# EAGLE design Router40 v2 (EAGLE 9.5.0)
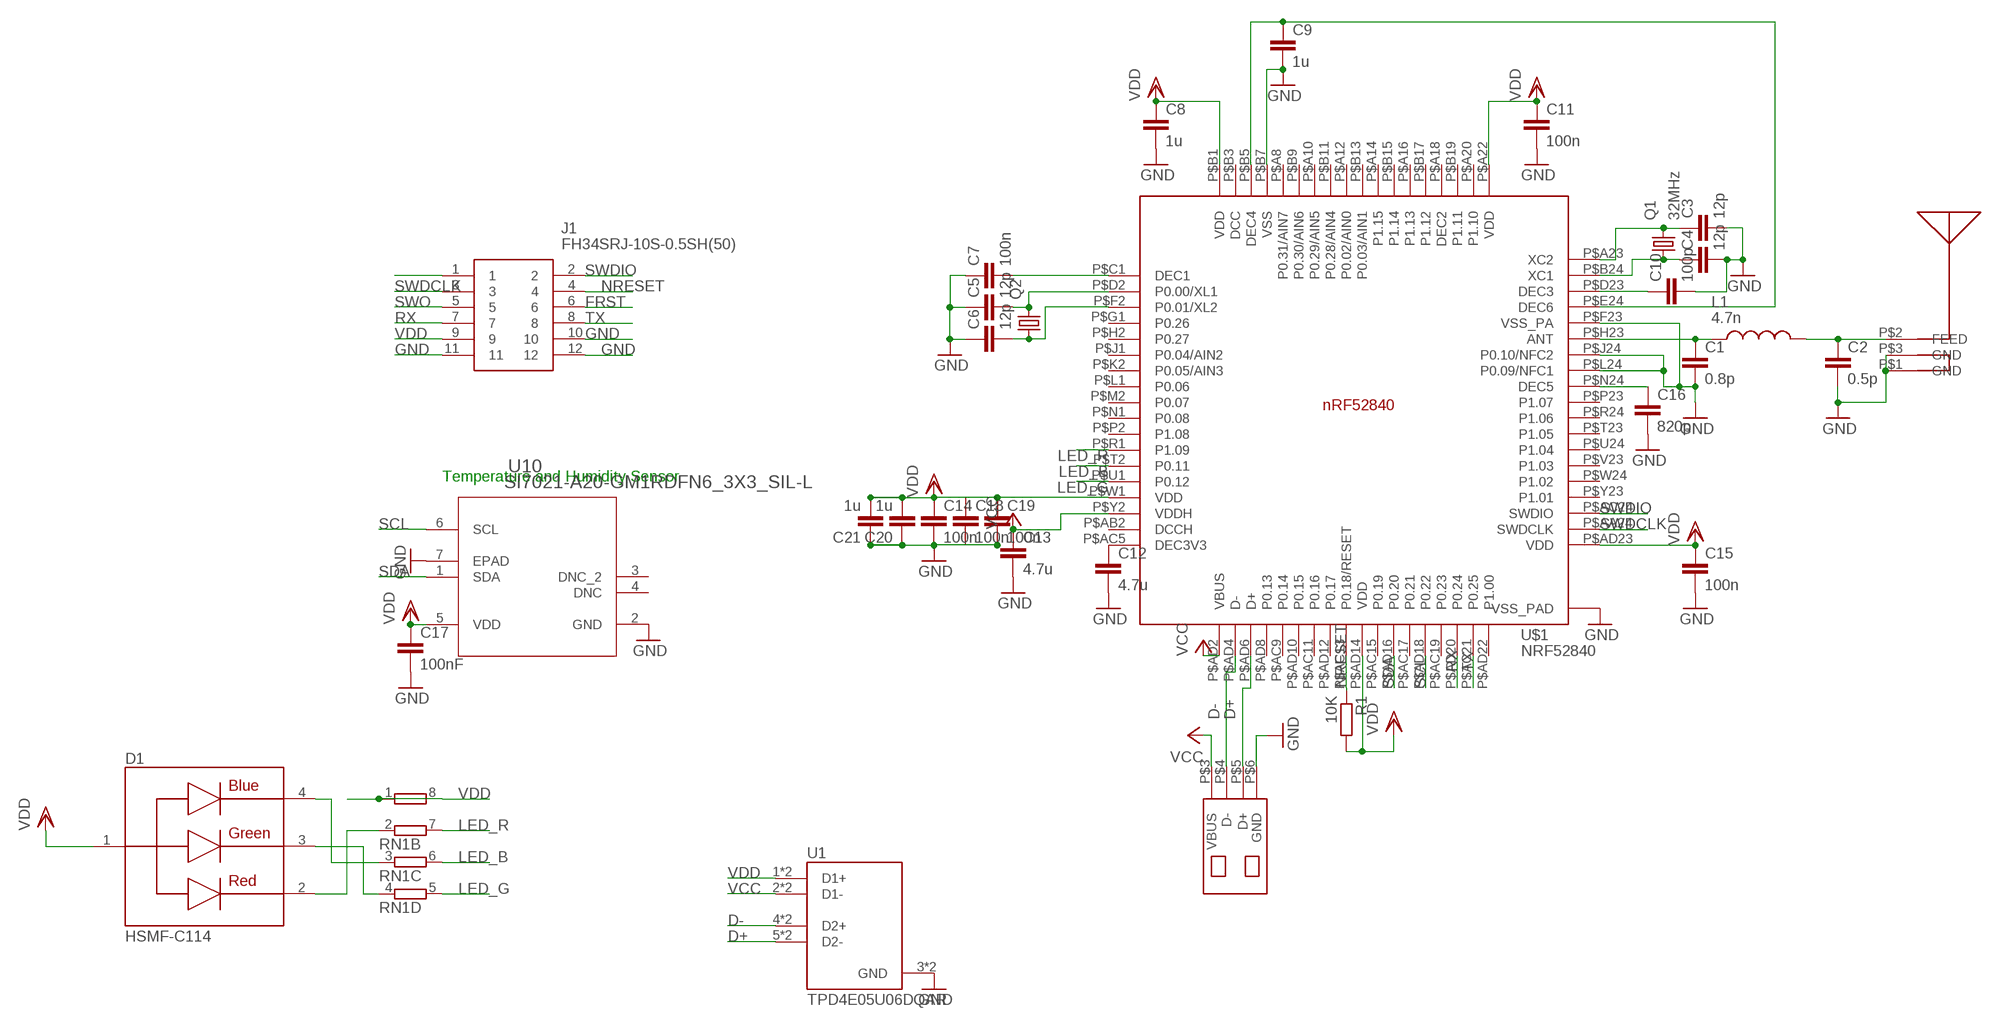
[diagram p0: schematic, sheet 1]

## Parts
C1  0.8p  CC0402  [C0402]
C2  0.5p  CC0402  [C0402]
C3  12p  CC0402  [C0402]
C4  12p  CC0402  [C0402]
C5  12p  CC0402  [C0402]
C6  12p  CC0402  [C0402]
C7  100n  CC0402  [C0402]
C8  1u  CC0402  [C0402]
C9  1u  CC0402  [C0402]
C10  100p  CC0402  [C0402]
C11  100n  CC0402  [C0402]
C12  4.7u  CC0402  [C0402]
C13  4.7u  CC0402  [C0402]
C14  100n  CC0402  [C0402]
C15  100n  CC0402  [C0402]
C16  820p  CC0402  [C0402]
C17  100nF  CC0402  [C0402]
C18  100n  CC0402  [C0402]
C19  100n  CC0402  [C0402]
C20  1u  CC0603R  [C0603R]
C21  1u  CC0603R  [C0603R]
D1  HSMF-C114  [DIOSC160X150X35-4N]
J1  FH34SRJ-10S-0.5SH(50)  [FH34SRJ10S05SH50]
L1  4.7n  MHQ0402P7N5JT000  [INDC0402X26N]
Q1  32MHz  KX-5  [2.0X1.6_KX-5]
Q2  KX-327-RT  [2.0X1.2]
R1  10K  RR0402  [R0402]
RN1  4R-N0402ARV341  [4X0402ARV341]
U1  TPD4E05U06DQAR  [TI_TPD4E05U06DQAR]
U10  SI7021-A20-GM1RDFN6_3X3_SIL-L  [DFN6_3X3_SIL-L]
U$1  NRF52840  [AQFN50P700X700X85_HS-74N]
U$2  USBA_MALE  [USBA_MALE]
U$4  CHIPANTENNAL2  [CHIPANTENNAL2]

## Nets
D+: U1.5(D2-) U1.6(D2-) U$1.P$AD6(D+) U$2.P$5(D+)
D-: U1.4(D2+) U1.7(D2+) U$1.P$AD4(D-) U$2.P$4(D-)
FRST: J1.6
GND: C1.2 C2.2 C3.2 C4.2 C5.1 C6.1 C7.1 C8.2 C9.2 C10.2 C11.2 C12.2 C13.2 C14.2 C15.2 C16.2 C17.2 C18.2 C19.2 C20.1 C21.1 J1.10 J1.11 J1.12 U1.3(GND) U1.8(GND) U10.2(GND) U10.7(EPAD) U$1.P$74(VSS_PAD) U$1.P$75(VSS_PAD) U$1.P$76(VSS_PAD) U$1.P$77(VSS_PAD) U$1.P$78(VSS_PAD) U$1.P$79(VSS_PAD) U$1.P$80(VSS_PAD) U$1.P$81(VSS_PAD) U$1.P$82(VSS_PAD) U$1.P$83(VSS_PAD) U$1.P$84(VSS_PAD) U$1.P$85(VSS_PAD) U$1.P$86(VSS_PAD) U$1.P$87(VSS_PAD) U$1.P$88(VSS_PAD) U$1.P$89(VSS_PAD) U$1.P$90(VSS_PAD) U$1.P$B7(VSS) U$1.P$F23(VSS_PA) U$1.P$J24(P0.10/NFC2) U$1.P$L24(P0.09/NFC1) U$2.P$6(GND) U$4.P$1(GND) U$4.P$3(GND)
LED_B: RN1.6 U$1.P$T2(P0.11)
LED_G: RN1.5 U$1.P$U1(P0.12)
LED_R: RN1.7 U$1.P$R1(P1.09)
N$1: C1.1 L1.1 U$1.P$H23(ANT)
N$2: C2.1 L1.2 U$4.P$2(FEED)
N$3: C3.1 Q1.3 U$1.P$A23(XC2)
N$4: C4.1 Q1.1 U$1.P$B24(XC1)
N$5: C5.2 Q2.2 U$1.P$D2(P0.00/XL1)
N$6: C6.2 Q2.1 U$1.P$F2(P0.01/XL2)
N$7: C7.2 U$1.P$C1(DEC1)
N$8: C9.1 U$1.P$B5(DEC4) U$1.P$E24(DEC6)
N$9: C10.1 U$1.P$D23(DEC3)
N$10: C12.1 U$1.P$AC5(DEC3V3)
N$12: C16.1 U$1.P$N24(DEC5)
N$14: J1.1
N$16: D1.2 RN1.2
N$17: D1.3 RN1.4
N$18: D1.4 RN1.3
NRESET: J1.4 R1.1 U$1.P$AC13(P0.18/RESET)
RX: J1.7 U$1.P$AD20(P0.24)
SCL: U10.6(SCL) U$1.P$AD18(P0.22)
SDA: U10.1(SDA) U$1.P$AD16(P0.20)
SWDCLK: J1.3 U$1.P$AA24(SWDCLK)
SWDIO: J1.2 U$1.P$AC24(SWDIO)
SWO: J1.5
TX: J1.8 U$1.P$AC21(P0.25)
VCC: C13.1 U1.2(D1-) U1.9(D1-) U$1.P$AD2(VBUS) U$1.P$Y2(VDDH) U$2.P$3(VBUS)
VDD: C8.1 C11.1 C14.1 C15.1 C17.1 C18.1 C19.1 C20.2 C21.2 D1.1 J1.9 R1.2 RN1.1 RN1.8 U1.1(D1+) U1.10(D1+) U10.5(VDD) U$1.P$A22(VDD) U$1.P$AD14(VDD) U$1.P$AD23(VDD) U$1.P$B1(VDD) U$1.P$W1(VDD)
Unconnected: U10.3(DNC_2) U10.4(DNC) U$1.P$A8(P0.31/AIN7) U$1.P$A10(P0.29/AIN5) U$1.P$A12(P0.02/AIN0) U$1.P$A14(P1.15) U$1.P$A16(P1.13) U$1.P$A18(DEC2) U$1.P$A20(P1.10) U$1.P$AB2(DCCH) U$1.P$AC9(P0.14) U$1.P$AC11(P0.16) U$1.P$AC15(P0.19) U$1.P$AC17(P0.21) U$1.P$AC19(P0.23) U$1.P$AD8(P0.13) U$1.P$AD10(P0.15) U$1.P$AD12(P0.17) U$1.P$AD22(P1.00) U$1.P$B3(DCC) U$1.P$B9(P0.30/AIN6) U$1.P$B11(P0.28/AIN4) U$1.P$B13(P0.03/AIN1) U$1.P$B15(P1.14) U$1.P$B17(P1.12) U$1.P$B19(P1.11) U$1.P$G1(P0.26) U$1.P$H2(P0.27) U$1.P$J1(P0.04/AIN2) U$1.P$K2(P0.05/AIN3) U$1.P$L1(P0.06) U$1.P$M2(P0.07) U$1.P$N1(P0.08) U$1.P$P2(P1.08) U$1.P$P23(P1.07) U$1.P$R24(P1.06) U$1.P$T23(P1.05) U$1.P$U24(P1.04) U$1.P$V23(P1.03) U$1.P$W24(P1.02) U$1.P$Y23(P1.01)

## Notes on the sheet
- Temperature and Humidity Sensor

## Library data of the parts
C1-C19 = eagle-ltspice:C: CAPACITOR, European symbol; SPICEMODEL: NONE; SPICEPREFIX: C
C20 C21 = eagle-ltspice:C: CAPACITOR, European symbol
D1 = HSMF-C114:HSMF-C114: LED Tri-Color Blue/Green/Red 468nm/523nm/637nm 4-Pin Chip LED T/R; AVAILABILITY: Unavailable; DESCRIPTION: LED RGB DIFFUSED CHIP SMD; MF: Broadcom Limited; MP: HSMF-C114; PACKAGE: 0606 Broadcom; PRICE: None
J1 = FH34SRJ-10S-0.5SH_50_:FH34SRJ-10S-0.5SH(50): HIROSE(HRS) - FH34SRJ-10S-0.5SH(50) - CONNECTOR, FFC/FPC, RCPT, 10POS, 1ROW Source: Datasheet <https://www.hirose.com/product/en/products/FH34SRJ/FH34SRJ-10S-0.5SH(50)/> Check prices <https://pricing.snapeda.com/search/part/FH34SRJ-10S-0.5SH%2850%29/?ref=eda>; AVAILABILITY: Good; DESCRIPTION: FFC & FPC Connectors 10POS 0.50MM R/A CONN FFC FPC; MF: Hirose Connector; MP: FH34SRJ-10S-0.5SH(50); PACKAGE: None; PRICE: None; PURCHASE-URL: https://pricing.snapeda.com/search/part/FH34SRJ-10S-0.5SH(50)/?ref=eda
L1 = MHQ0402P7N5JT000:MHQ0402P7N5JT000: 221 NH 5% GOLD TERMINAL; AVAILABILITY: Unavailable; DESCRIPTION: FIXED IND 7.5NH 200MA 1.2 OHM; MF: TDK; MP: MHQ0402P7N5JT000; PACKAGE: 0402 TDK; PRICE: None
Q1 = crystal-geyer_V1_0:KX: Quartz Crystals (MHz) SMD: KX - Serie Model Size l/w/h [mm] Frequency Range Frequency Stability Temp. Range [°C] Load Capacitance AECQ 200 availabel Datasheet KX-4 KX-5 KX-6 KX-7 KX-9A KX-9B KX-12A KX-12B KX-13 KX-20 KX-K KX-KS 1.6/1.2/0.3 2.0/1.6/0.45 2.5/2.0/0.55 3.2/2.5/0.8 5.0/3.2/1.0 5.0/3.2/1.1 6.0/3.5/1.1 6.0/3.5/1.0 7.0/5.0 /1.3 11.6/5.5/1.6 12.3/4.5/4.2 12.3/4.5/3.2 24.0 ~ 80.0 MHz 16.0 ~ 80.0 MHz 12.0 ~ 80.0 MHz 8.0 ~ 60.0 MHz 7,68 ~ 300,0 MHz 8,0 ~ 50,0 MHz 8,0 ~ 150,0 MHz 8,0 ~ 50,0 MHz 6,0 ~ 160,0 MHz 3,579 ~ 25,0 MHz 3,579 ~ 70,0 MHz 3,579 ~ 70,0 MHz ±10 … ±50ppm ±10 … ±50ppm ±10 … ±50ppm ±10 … ±50ppm ±10 … ±50ppm ±10 … ±50ppm ±10 … ±50ppm ±10 … ±50ppm ±10 … ±50ppm ±50ppm ±10 … ±50ppm ±10 … ±50ppm (*) -40°C …+85°C (*) -40°C …+125°C (*) -40°C …+125°C (*) -40°C …+125°C (*) -40°C …+105°C (*) -40°C …+105°C (*) -40°C …+125°C (*) -40°C …+105°C (*) -40°C …+105°C (*) -40°C …+105°C (*) -40°C …+85°C (*) -40°C …+85°C 8, 8…16 8, 8…16 10, 8…16 12, 7…20 16, 10…20 16, 10…20 16, 10…20 16, 12…20 16, 12…20 16, 12…20 16, 12…30 16, 12…30 - yes yes yes - - - - - - - - KX-4.pdf <http://www.geyer-electronic.de/uploads/tx_userartikelfrequenz/GEYER-KX-4.pdf> KX-5.pdf <http://www.geyer-electronic.de/uploads/tx_userartikelfrequenz/GEYER-KX-5.pdf> KX-6.pdf <http://www.geyer-electronic.de/uploads/tx_userartikelfrequenz/GEYER-KX-6.pdf> KX-7.pdf <http://www.geyer-electronic.de/uploads/tx_userartikelfrequenz/GEYER-KX-7.pdf> KX-9A.pdf <http://www.geyer-electronic.de/uploads/tx_userartikelfrequenz/GEYER-KX-9A.pdf> KX-9B.pdf <http://www.geyer-electronic.de/uploads/tx_userartikelfrequenz/GEYER-KX-9B.pdf> KX-12A.pdf <http://www.geyer-electronic.de/uploads/tx_userartikelfrequenz/GEYER-KX-12A.pdf> KX-12B.pdf <http://www.geyer-electronic.de/uploads/tx_userartikelfrequenz/GEYER-KX-12B.pdf> KX-13.pdf <http://www.geyer-electronic.de/uploads/tx_userartikelfrequenz/GEYER-KX-13.pdf> KX-20.pdf <http://www.geyer-electronic.de/uploads/tx_userartikelfrequenz/GEYER-KX-20.pdf> KX-K.pdf <http://www.geyer-electronic.de/uploads/tx_userartikelfrequenz/GEYER-KX-K.pdf> KX-KS.pdf <http://www.geyer-electronic.de/uploads/tx_userartikelfrequenz/GEYER-KX-KS.pdf> <http://www.geyer-electronic.de/fileadmin/template/img/logo-geyer-electronic.png> Details see: http://www.geyer-electronic.de/Frequenz-Produkte.9.0.html Created 2016-06-07, Hans Locher 2016 (C) Geyer Quartz Technology KX4,KX5,KX6,KX7,KX9A,KX9B,KX12A,KX12B,KX13,KX20,KXK,KXKS;1612;2016;2520;3225;5032;6035;7050;11655;12345;1,6x1,2;2,0x1,6;2,5x2,0;3,2x2,5;5,0x3,2;6,0x3,5;7,0x5,0;11,6x5,5;12,3x4,5;12,3x4,5;1.6x1.2;2.0x1.6;2.5x2.0;3.2x2.5;5.0x3.2;6.0x3.5;7.0x5.0;11.6x5.5;12.3x4.5;12.3x4.5;
Q2 = crystal-geyer_V1_0:KX-327: Tuning Fork Crystals (kHz) SMD: KX327 - Serie Model Size l/w/h [mm] Frequency Range Frequency Stability Temp. Range [°C] Load Capacitance AECQ 200 availabel Datasheet KX-327VT KX-327FT KX-327RT KX-327NHT KX-327NHF KX-327L KX-327S 1.25/1.05/0.5 1.6/1.0/0.5 2.0/1.2/0.6 3.2/1.5/0.8 3.2/1.5/0.8 7.0/1.5/1.4 8.2/3.8/2.5 32,768 kHz 32,768 kHz 32,768 kHz 32,768 kHz 32,768 kHz 32,768 kHz 32,768 kHz ±10 … ±20ppm ±10 … ±20ppm ±10 … ±20ppm ±10 … ±20ppm ±10 … ±20ppm ±10 … ±20ppm ±5 … ±20ppm (*) -40°C …+85°C (*) -40°C …+85°C (*) -40°C …+85°C (*) -40°C …+85°C (*) -40°C …+125°C (*) -40°C …+85°C (*) -40°C …+85°C 7/9/12,5 7/9/12,5 7/9/12,6 7/9/12,5 9/12,5 7/9/12,5 6/12,5 - - - - yes - - KX-327VT.pdf <http://www.geyer-electronic.de/uploads/tx_userartikelfrequenz/GEYER-KX-327VT.pdf> KX-327FT.pdf <http://www.geyer-electronic.de/uploads/tx_userartikelfrequenz/GEYER-KX-327FT.pdf> KX-327RT.pdf <http://www.geyer-electronic.de/uploads/tx_userartikelfrequenz/GEYER-KX-327RT.pdf> KX-327NHT.pdf <http://www.geyer-electronic.de/uploads/tx_userartikelfrequenz/GEYER-KX-327NHT.pdf> KX-327NHF.pdf <http://www.geyer-electronic.de/uploads/tx_userartikelfrequenz/GEYER-KX-327NHF.pdf> KX-327L.pdf <http://www.geyer-electronic.de/uploads/tx_userartikelfrequenz/GEYER-KX-327L.pdf> KX-327S.pdf <http://www.geyer-electronic.de/uploads/tx_userartikelfrequenz/GEYER-KX-327S.pdf> <http://www.geyer-electronic.de/fileadmin/template/img/logo-geyer-electronic.png> Details see: http://www.geyer-electronic.de/Frequenz-Produkte.9.0.html Created 2016-06-07, Hans Locher 2016 (C) Geyer Quartz Technology KX327VT,KX327FT,KX327RT,KX327NHT,KX327NHF,KX327S,KX327L;125105;1610;2012;3215;7015;8238;1,25x1,05,1.25x1.05;1,6x1,0,1.6x1.0;2,0x1,2,2.0x1.2;3,2x1,5,3.2x1.5;8,2x3,8,8.2x3.8,7.0x1.5,7,0x1,532.768kHz
R1 = eagle-ltspice:R: RESISTOR, European symbol; SPICEMODEL: NONE; SPICEPREFIX: R
RN1 = resistor-dil:4R-N: Array Chip Resistor Source: RS Component / Phycomp; OC_FARNELL: unknown; OC_NEWARK: unknown
U1 = TPD4E05U06DQAR:TPD4E05U06DQAR: 4 Channel Ultra Low Capacitance IEC ESD Protection Diodes 10-USON -40 to 125 Check prices <https://pricing.snapeda.com/search/part/TPD4E05U06DQAR/?ref=eda>; AVAILABILITY: Warning; DESCRIPTION: 4-channel ultra-low-capacitance IEC ESD protection diode 10-USON -40 to 125; MF: Texas Instruments; MP: TPD4E05U06DQAR; PACKAGE: USON-10 Texas Instruments; PRICE: None; PURCHASE-URL: https://pricing.snapeda.com/search/part/TPD4E05U06DQAR/?ref=eda
U10 = SI7021:SI7021-A20-GM1R; BUILT_BY: EMA_Jessica; COPYRIGHT: Copyright (C) 2018 Accelerated Designs. All rights reserved; MANUFACTURER_PART_NUMBER: SI7021-A20-GM1R; SOURCELIBRARY: Silicon_Labs_2020-01-01; VENDOR: Silicon Labs
U$1 = Nordic_nRF:NRF52840: nRF52840 Features Advanced Single chip 2.4 GHz multi-protocol SoC 32-bit ARM Cortex-M4F Processor 1.7v to 5.5v operation 1MB flash + 256kB RAM Bluetooth 5 support for long range and high throughput 802.15.4 radio support On-chip NFC PPI –Programmable Peripheral Interconnect Automated power management system with automatic power management of each peripheral Configurable I/O mapping for analog and digital I/O 48 x GPIO 1 x QSPI 4 x Master/Slave SPI 2 x Two-wire interface (I²C) I²S interface 2 x UART 4 x PWM USB 2.0 controller ARM TrustZone CryptoCell-310 Cryptographic and security module AES 128-bit ECB/CCM/AAR hardware accelerator Digital microphone interface (PDM) Quadrature decoder 12-bit ADC Low power comparator On-chip 50Ω balun On-air compatible with nRF52, nRF51 and nRF24 Series Applications Advanced high performance wearables Wearables for secure payments Virtual Reality/Augmented Reality systems Smart Home sensor networks Smart city sensor networks High performance HID controllers Internet of Things (IoT) sensor networks Smart door locks Smart lighting networks Connected white goods
U$2 = USB:USBA_MALE
U$4 = CHIPANTENNA:CHIPANTENNAL2

## Board
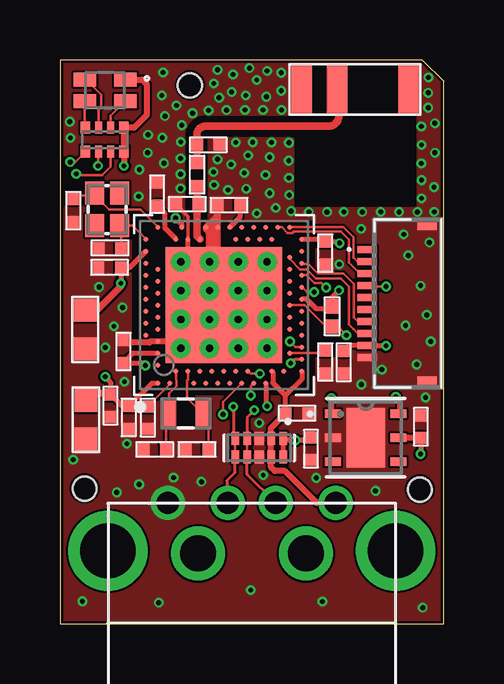
[diagram p1: board, top side]
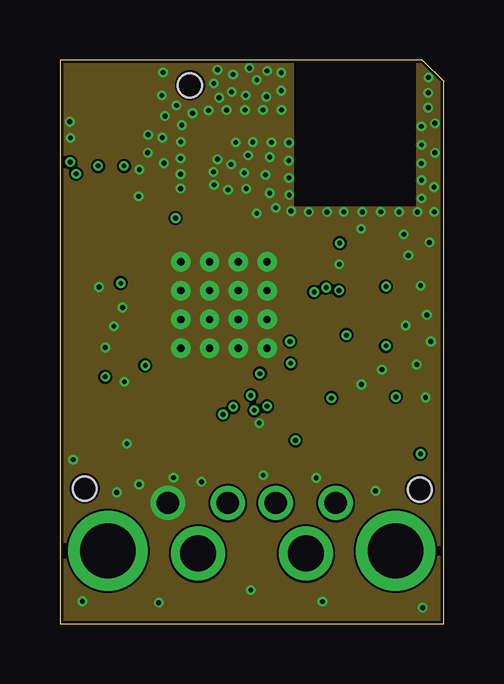
[diagram p2: board, inner layer Route2]
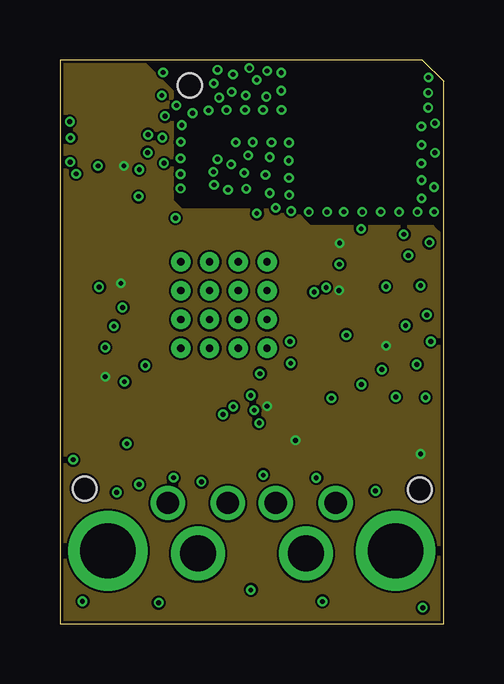
[diagram p3: board, inner layer Route15]
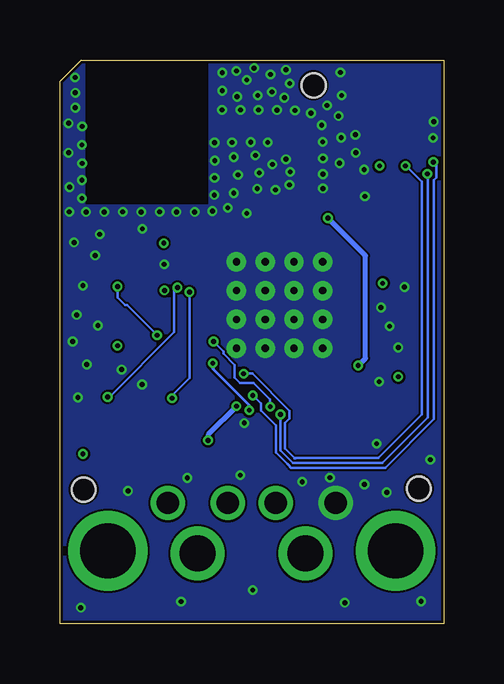
[diagram p4: board, bottom side, seen from below]

Size 16 x 23.5 mm. Coordinates in mm from the lower left corner, seen from the top.
Outline: 0,0 16,0 16,22.61 15.11,23.5 0,23.5 0,0
Copper layers (1+2*15+16): Top 0.035mm / dielectric 0.51mm / Route2 0.035mm / dielectric 0.15mm / Route15 0.035mm / dielectric 0.2mm / Bottom 0.035mm
Design rules "default *": minimum track width 3.5mil, minimum drill 0.2mm, track to track 3.5mil, track to pad 3.5mil, pad to pad 5mil, via to via 5mil, smd to smd 5mil, copper to edge 5mil, drill to drill 5mil, minimum pad ring 10mil, minimum via ring 4mil, stop-mask expansion 0mil, vias tented up to drill 40mil, thermal gap 0mil
Holes 1 mm at 1.03,5.63 5.42,22.44 15.01,5.59
tRestrict: 13 lines

### Footprints (pad centres in the part's own frame; a part is rotated, then mirrored left to right if it is on the bottom)
C0402 = smd 0.5 x 0.5: 1 -0.475,0; 2 0.475,0
C0603R = smd 0.95 x 0.95: 1 -0.85,0; 2 0.75,0
DIOSC160X150X35-4N = smd 0.94 x 0.57: 1 -0.845,-0.45; 2 -0.845,0.45; 3 0.845,0.45; 4 0.845,-0.45
FH34SRJ10S05SH50 = smd 0.3 x 0.8: 1 2.25,1.55; 2 1.75,1.55; 3 1.25,1.55; 4 0.75,1.55; 5 0.25,1.55; 6 -0.25,1.55; 7 -0.75,1.55; 8 -1.25,1.55; 9 -1.75,1.55; 10 -2.25,1.55 | smd 0.4 x 0.8: 11 -3.25,-0.95; 12 3.25,-0.95
INDC0402X26N = smd 0.5 x 0.5: 1 -0.732,0; 2 0.232,0
2.0X1.6_KX-5 = smd 0.95 x 0.8: 1 -0.675,-0.525; 2 0.675,-0.525; 3 0.675,0.525; 4 -0.675,0.525
2.0X1.2 = smd 0.6 x 1.1: 1 -0.7,0; 2 0.7,0
R0402 = smd 0.6 x 0.55: 1 -0.425,0; 2 0.425,0
4X0402ARV341 = smd 0.4 x 0.5: 1 -0.8,-0.5; 4 0.8,-0.5; 5 0.8,0.5; 8 -0.8,0.5 | smd 0.3 x 0.5: 2 -0.25,-0.5; 3 0.25,-0.5; 6 0.25,0.5; 7 -0.25,0.5
TI_TPD4E05U06DQAR = smd 0.55 x 0.3: 1 -0.385,1; 2 -0.385,0.5; 4 -0.385,-0.5; 5 -0.385,-1; 6 0.385,-1; 7 0.385,-0.5; 9 0.385,0.5; 10 0.385,1 | smd 0.55 x 0.4: 3 -0.385,0; 8 0.385,0
DFN6_3X3_SIL-L = smd 0.66 x 0.356: 1 -1.372,0.991; 2 -1.372,0; 3 -1.372,-0.991; 4 1.372,-0.991; 5 1.372,0; 6 1.372,0.991 | smd 1.6 x 2.489: 7 0,0
AQFN50P700X700X85_HS-74N = smd 4.85 x 4.85: P$74 0,0 | drill 0.3 pad 0.6: P$75 -1.8,1.8; P$76 -0.6,1.8; P$77 0.6,1.8; P$78 1.8,1.8; P$79 -1.8,0.6; P$80 -0.6,0.6; P$81 0.6,0.6; P$82 1.8,0.6; P$83 -1.8,-0.6; P$84 -0.6,-0.6; P$85 0.6,-0.6; P$86 1.8,-0.6; P$87 -1.8,-1.8; P$88 -0.6,-1.8; P$89 0.6,-1.8; P$90 1.8,-1.8 | smd 0.2 x 0.2: P$A8 -1.25,3.25; P$A10 -0.75,3.25; P$A12 -0.25,3.25; P$A14 0.25,3.25; P$A16 0.75,3.25; P$A18 1.25,3.25; P$A20 1.75,3.25; P$A22 2.25,3.25; P$A23 2.75,3.25; P$AA24 3.25,-2.25; P$AB2 -2.75,-2.5; P$AC5 -2,-2.75; P$AC9 -1,-2.75; P$AC11 -0.5,-2.75; P$AC13 0,-2.75; P$AC15 0.5,-2.75; P$AC17 1,-2.75; P$AC19 1.5,-2.75; P$AC21 2,-2.75; P$AC24 3.25,-2.75; P$AD2 -2.75,-3.25; P$AD4 -2.25,-3.25; P$AD6 -1.75,-3.25; P$AD8 -1.25,-3.25; P$AD10 -0.75,-3.25; P$AD12 -0.25,-3.25; P$AD14 0.25,-3.25; P$AD16 0.75,-3.25; P$AD18 1.25,-3.25; P$AD20 1.75,-3.25; P$AD22 2.25,-3.25; P$AD23 2.75,-3.25; P$B1 -3.25,2.75; P$B3 -2.5,2.75; P$B5 -2,2.75; P$B7 -1.5,2.75; P$B9 -1,2.75; P$B11 -0.5,2.75; P$B13 0,2.75; P$B15 0.5,2.75; P$B17 1,2.75; P$B19 1.5,2.75; P$B24 3.25,2.75; P$C1 -3.25,2.25; P$D2 -2.75,2; P$D23 2.75,2; P$E24 3.25,1.75; P$F2 -2.75,1.5; P$F23 2.75,1.5; P$G1 -3.25,1.25; P$H2 -2.75,1; P$H23 2.75,1; P$J1 -3.25,0.75; P$J24 3.25,0.75; P$K2 -2.75,0.5; P$L1 -3.25,0.25; P$L24 3.25,0.25; P$M2 -2.75,0; P$N1 -3.25,-0.25; P$N24 3.25,-0.25; P$P2 -2.75,-0.5; P$P23 2.75,-0.5; P$R1 -3.25,-0.75; P$R24 3.25,-0.75; P$T2 -2.75,-1; P$T23 2.75,-1; P$U1 -3.25,-1.25; P$U24 3.25,-1.25; P$V23 2.75,-1.5; P$W1 -3.25,-1.75; P$W24 3.25,-1.75; P$Y2 -2.75,-2; P$Y23 2.75,-2
USBA_MALE = drill 2.3: P$1 -6,0; P$2 6,0 | drill 0.92: P$3 3.5,2; P$4 1,2; P$5 -1,2; P$6 -3.5,2 | drill 1.5: P$7 -2.24,-0.11; P$8 2.26,-0.11
CHIPANTENNAL2 = smd 0.85 x 2: P$1 0.45,1; P$2 1.925,1; P$3 4.9,1

### Placement (x,y rotation side)
C1  5.31,17.49 180 top
C2  6.19,19.96 0 top
C3  2.08,15.66 180 top
C4  0.56,17.22 270 top
C5  3.96,7.26 0 top
C6  5.72,7.26 0 top
C7  3.66,8.58 90 top
C8  2.11,9.08 270 top
C9  2.65,11.35 90 top
C10  4.05,17.91 90 top
C11  11.07,15.45 270 top
C12  11.07,10.91 270 top
C13  9.89,8.77 0 top
C14  11.84,10.9 270 top
C15  15.05,8.21 90 top
C16  7.05,17.45 180 top
C17  10.47,7.29 270 top
C18  2.87,8.59 270 top
C19  2.07,14.85 180 top
C20  1.05,12.31 90 top
C21  1.08,8.55 90 top
D1  1.88,22.23 180 top
J1  14.36,13.35 90 top
L1  5.72,18.97 90 top
Q1  1.97,17.27 270 top
Q2  5.25,8.76 180 top
R1  11.35,12.81 90 top
RN1  1.87,20.17 180 top
U1  8.31,7.33 270 top
U10  12.75,7.75 0 top
U$1  6.84,13.28 90 top
U$2  8,3.03 0 top
U$4  9.63,21.27 0 top

### Tracks (layer width: path | path; a pad name or v marks a point on that pad's centre or on a via)
D+  (via drill 0.2)
  Top 0.102: U1.6 U1.5 | v9.59,11.76 9.82,11.53 U$1.P$AD6
  Top 0.127: U$2.P$5 6.96,5.07 6.96,5.96 7.31,6.31 U1.6 | v7.23,9.04 7.23,7.79 U1.5
  Bottom 0.102: v9.59,11.76 9.18,11.35 9.18,11.26 8.72,10.79 8.72,10.26 8.5,10.04 7.93,10.04 7.23,9.34 v7.23,9.04
D-  (via drill 0.2)
  Top 0.102: U1.4 U1.7
  Top 0.127: U$2.P$4 7.81,6.22 U1.7 | U1.4 7.81,8.59 v8.11,8.88 v8.11,8.89 | v9.62,10.85 9.8,11.03 U$1.P$AD4
  Bottom 0.127: v9.62,10.85 9.62,10.62 8.11,9.11 v8.11,8.89
GND  (via drill 0.2)
  Top 0.102: 3.25,11.75 3.71,11.75 3.73,11.78 U$1.P$B7 | 4.49,11.78 4.74,11.78 U$1.P$75
  Top 0.15: U$1.P$F23 5.35,16.04 5.35,16.98 C1.2
  Top 0.203: U$1.P$74 5.34,14.78 U$1.P$F23
  Top 0.254: C9.2 2.65,11.79 2.72,11.71 3.72,11.71 3.79,11.78 U$1.P$B7 | U$1.P$B7 4.49,11.78 | U$1.P$J24 6.43,16.53 | 6.43,16.53 U$1.P$L24 6.58,16.55 | 6.58,16.55 C16.2 6.58,17.02 6.33,16.77 | U$1.P$J24 6.33,16.77 | 6.58,16.55 6.55,16.55 6.33,16.77 | 6.58,16.55 6.58,16.05 | 6.58,16.05 6.58,15.41 U$1.P$82 6.21,15.11 6.21,16.33 6.09,16.45 U$1.P$J24 | U$1.P$J24 6.4,16.22 | 6.4,16.22 6.43,16.19 | 6.43,16.19 6.58,16.05 | 6.43,16.19 6.43,16.53 | U$1.P$74 6.4,13.72 6.4,16.22
  other vias: 11.65,14.98 15.61,17.17 14.91,17.16 14.15,17.16 13.38,17.17 12.61,17.16 8.82,20.06 9.55,20.05 9.54,19.3 9.55,18.58 9.56,17.87 11.84,17.17 11.14,17.16 10.38,17.16 9.64,17.2 9.24,21.42 4.34,19.2 9,17.33 7.14,19.15 5.03,18.14 8.04,20.07 7.69,18.79 5.08,20.78 5.03,19.4 7.33,20.06 8.47,21.42 2.25,12.4 8.75,19.45 8.57,18.71 5.03,18.74 7.72,21.42 12.56,16.46 7.85,19.52 8.75,17.95 6.4,18.83 9.23,22.22 4.74,6.08 3.3,5.8 2.37,5.47 1.89,11.51 6.2,21.4 2.79,7.5 5.9,5.91 2.61,13.18 6.95,21.41 9.23,22.97 0.55,6.83 2.69,10.08 8.21,17.1 7.01,18.08 6.57,19.36 1.63,14.03 7.77,18.13 6.43,18.29 5.53,21.28 5.04,20.08 10.95,0.92 7.96,1.4 3.68,20.38 3.66,19.63 8.21,22.67 4.12,0.87 0.44,20.25 4.38,21.16 7.22,22.9 7.16,22.17 15.04,14.09 15.47,11.76 4.86,21.6 4.25,22.02 0.41,20.93 15.13,0.66 6.42,22.52 7.9,23.16 6.57,23.09 8.64,23.04 0.94,0.93 15.41,15.89 14.42,12.43 3.31,18.93 15.3,12.87 14.53,15.35 13.43,10.59 14.34,16.23 14.88,10.8 4.3,22.98 10.69,6.07 8.48,6.19 8.31,8.36 4.27,20.26 8.61,21.97 13.16,5.53 15.25,9.43 3.28,17.81 6.64,21.93 7.75,22.02 12.57,9.97 15.37,22.77 15.36,22.13 15.36,21.51 15.07,20.73 15.08,19.96 15.07,19.19 15.08,18.49 15.08,17.73 15.64,19.63 15.64,20.86 15.6,18.2
  pour Top: 9.69,23.47 9.69,16.87 2.92,16.87 2.92,9.45 10.72,9.45 10.72,16.94 15.92,16.94 15.92,0 -0.03,0 -0.03,23.47
  pour Top: 9.69,17.29 15.94,17.29 15.94,16.9 9.68,16.9 9.68,16.93 9.68,17.29
  pour Top: 15.06,23.48 15.99,23.48 15.99,21.77 15.99,17.27 15.18,17.27 14.94,17.27 14.94,23.39 14.94,23.48 15.05,23.48
  pour Route2: 0.03,23.48 9.66,23.48 9.66,19.06 9.66,17.3 14.88,17.3 14.97,17.3 14.97,17.98 14.97,23.4 15.84,23.4 15.93,23.4 15.93,22.26 15.93,0.04 0.02,0.04 0.02,23.48
  pour Bottom: 0.09,23.54 9.72,23.54 9.72,19.12 9.72,17.36 14.94,17.36 15.03,17.36 15.03,18.04 15.03,23.46 15.9,23.46 15.99,23.46 15.99,22.32 15.99,0.1 0.08,0.1 0.08,23.54
LED_B  (via drill 0.2)
  Top 0.102: U$1.P$T2 7.95,10.42 v8.34,10.42 | v1.59,19.08 1.59,19.64 RN1.6
  Bottom 0.102: v8.34,10.42 7.97,10.42 6.43,8.87 6.43,8.56 6.62,8.37 6.62,7.29 6.22,6.9 | 6.22,6.9 2.72,6.9 0.91,8.71 0.91,18.43 1.56,19.08 v1.59,19.08 | 6.22,6.9 6.21,6.89 6.18,6.89
LED_G  (via drill 0.2)
  Top 0.102: U$1.P$U1 7.96,9.9 v7.96,9.51 | v0.42,19.25 0.65,19.25 RN1.5
  Bottom 0.102: v7.96,9.51 v7.95,9.51 7.61,9.17 7.61,8.88 7,8.27 7,7.14 6.52,6.66 6.46,6.61 6.36,6.5 2.43,6.5 0.4,8.53 0.4,18.49 0.3,18.59 0.3,19.12 v0.42,19.25
LED_R  (via drill 0.2)
  Top 0.102: U$1.P$R1 6.8,9.24 v6.8,8.71 | v0.68,18.75 0.73,18.7 1.77,18.7 2.12,19.05 RN1.7
  Bottom 0.102: v6.8,8.71 6.8,7.21 6.29,6.7 2.56,6.7 0.66,8.6 0.66,18.73 v0.68,18.75
N$1
  Top 0.305: U$1.P$H23 5.72,16.15 5.72,17.43 C1.1 5.72,17.55 L1.1
N$2
  Top 0.305: L1.2 C2.1 5.71,20.39 arc-90 6.07,20.74 11.21,20.74 arc90 11.63,21.16 11.63,22.2 arc90 U$4.P$2
N$3
  Top 0.102: U$1.P$A23 3.02,16.59 Q1.3 2.56,16.54 C3.1
N$4
  Top 0.102: U$1.P$B24 3.36,17.26 2.05,17.26 1.45,17.87 Q1.1 1.33,17.84 0.7,17.84 C4.1
N$5
  Top 0.102: Q2.2 4.55,8.92 | 4.55,8.92 4.55,9.6 4.87,9.91 4.87,10.14 4.84,10.17 U$1.P$D2 | C5.2 4.43,8.8 4.55,8.92
N$6
  Top 0.102: U$1.P$F2 5.34,10.17 5.31,10.14 5.31,9.4 Q2.1 6.2,8.52 C6.2
N$7
  Top 0.102: C7.2 4.59,9.98 U$1.P$C1
N$8  (via drill 0.2)
  Top 0.102: U$1.P$B5
  Top 0.2: v3.56,10.76 3.44,10.88 C9.1 3.05,11.28 U$1.P$B5 | U$1.P$E24 5.09,16.64 v4.83,16.91
  Bottom 0.2: v3.56,10.76 3.26,11.06 3.26,15.34 v4.83,16.91
N$9
  Top 0.102: 4.16,17.33 C10.1
  Top 0.2: U$1.P$D23 4.38,16.49 4.38,17.11 4.16,17.33
N$10
  Top 0.102: U$1.P$AC5 10.96,11.28 C12.1
N$12
  Top 0.2: U$1.P$N24 7.53,16.96 C16.1
N$16
  Top 0.102: RN1.2 2.12,21.18 D1.2
N$17
  Top 0.102: RN1.4 1.03,20.7 D1.3
N$18
  Top 0.102: RN1.3 1.62,21.41 1.73,21.52 1.73,22.04 1.09,22.68 D1.4
NRESET  (via drill 0.2)
  Top 0.102: U$1.P$AC13 10.19,13.28 11.09,12.38 R1.1 11.59,12.38 v11.95,12.02 | v13.6,14.05 12.86,14.05 J1.4
  Bottom 0.102: v11.95,12.02 13.21,13.28 13.29,13.28 13.6,13.59 v13.6,14.05
RX
  Top 0.102: J1.7 12.42,12.6 12.25,12.77 12.25,14.15 11.81,14.59 10.76,14.59 10.37,14.98 10.14,14.98 U$1.P$AD20
SCL  (via drill 0.2)
  Top 0.102: U10.6 14.12,9.34 v14.01,9.45 | v11.1,14.01 10.91,14.2 10.6,14.2 10.28,14.53 U$1.P$AD18
  Bottom 0.102: v14.01,9.45 13.93,9.45 11.23,12.15 11.23,13.88 v11.1,14.01
SDA  (via drill 0.2)
  Top 0.102: v10.6,13.82 10.3,13.82 U$1.P$AD16 | v11.32,9.4 11.38,9.34 U10.1
  Bottom 0.102: v10.6,13.82 10.6,10.24 11.32,9.52 v11.32,9.4
SWDCLK
  Top 0.102: U$1.P$AA24 9.25,16.53 9.49,16.29 9.69,16.29 9.74,16.34 11.73,16.34 12.06,16.01 12.06,15.06 12.52,14.6 J1.3
SWDIO
  Top 0.102: J1.2 12.4,15.1 12.25,15.25 12.25,16.11 11.83,16.53 U$1.P$AC24
TX
  Top 0.102: U$1.P$AC21 9.59,15.19 10.01,14.77 10.31,14.77 10.68,14.39 11.71,14.39 12.05,14.06 12.05,12.47 12.24,12.28 | J1.8 12.42,12.1 12.24,12.28 | 12.24,12.28
VCC
  Top 0.127: U1.9 U1.2 8.81,7.83 8.81,8.16 | 9.39,8.75 C13.1 9.41,9.51 9.35,9.57 9.31,9.61
  Top 0.2: U$1.P$Y2 8.88,10.49 8.88,10.04 9.31,9.61 | 9.35,9.57 9.39,9.53 9.39,8.75 | U$1.P$AD2 10.09,10.18 9.41,9.51
  Top 0.254: U$2.P$3 10.71,5.03 9.38,6.36 8.96,6.36 8.81,6.51 U1.9 8.81,7.83 | U1.2 8.81,8.16 9.39,8.75
VDD  (via drill 0.2)
  Top 0.102: U1.10 9.31,7.64 U1.1 10.42,7.71 C17.1 | C11.1
  Top 0.2: U$1.P$A22 2.91,14.85 C19.1 v2.54,14.2 v2.54,14.19 | U$1.P$B1 3.83,10.03 C18.1 2.6,9.06 C8.1 2.11,9.61 2.11,10.07 v1.89,10.29 | C17.1 10.35,7.64 v9.82,7.64 9.31,7.64 | U1.1 U1.10 | U$1.P$AD23 10.96,16.03 C11.1 | U$1.P$W1 8.59,9.11 v8.64,9.06 | C14.1 12.06,11.6 12.13,11.6 J1.9 13.58,11.6 v13.6,11.58 | C11.1 11.61,15.93 v11.67,15.86 | U$1.P$AD14 10.28,13.53 10.67,13.14 11.26,13.14 R1.2 11.35,13.6 v11.64,13.89 | C15.1 v15.05,7.07 v15.04,7.07
  Top 0.254: C15.1 14.14,7.74 U10.5 | D1.1 3.44,22.68 3.62,22.5 3.62,21.2 3.09,20.67 RN1.1 RN1.8 v2.67,19.08 | v2.54,14.2 2.54,14.06 1.54,13.06
  Top 0.3: C21.2 1.39,9.61 2.11,9.61 | C20.2 1.54,13.06 2.54,14.06 v2.54,14.19
  Bottom 0.2: v8.64,9.06 9.82,7.88 v9.82,7.64
  pour Route15: 15.96,0.03 0.03,0.03 0.03,7.81 0.03,23.39 0.05,23.41 3.41,23.41 4.64,22.18 4.64,17.62 5.04,17.22 9.71,17.22 10.39,16.54 12.85,16.54 15.52,16.54 15.92,16.14 15.92,0.09 15.96,0.05